# Altium project SSFocuser-C-DRV8825.PrjPcb
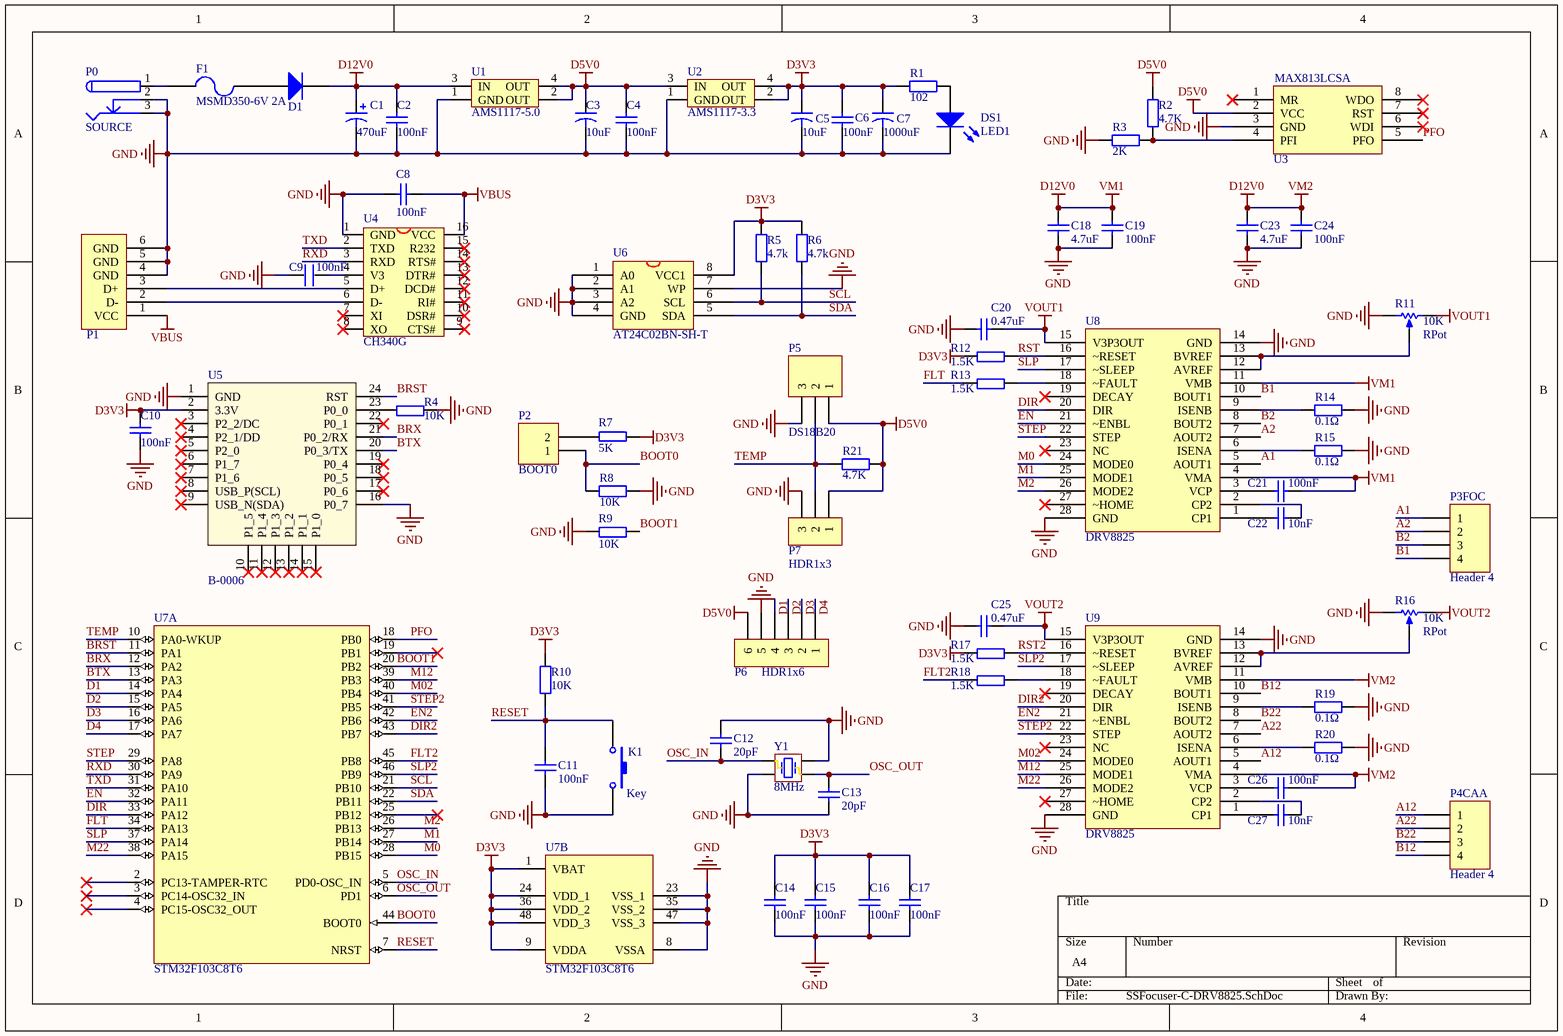
[diagram p0: SSFocuser-C-DRV8825.SchDoc]
1 sheet, 70 parts. Net scope: global (net labels, ports and power ports of the same name join across sheets).
Board file: SSFocuser-C-DRV8825.PcbDoc

## Sheet SSFocuser-C-DRV8825.SchDoc
size A4

### Parts
C1  470uF  [16V/470U(CD10X10D5)]
C2  100nF  [0603C]
C3  10uF  [3216]
C4  100nF  [0603C]
C5  10uF  [3216]
C6  100nF  [0603C]
C7  1000uF  [16V/470U(CD10X10D5)]
C8  100nF  [0603C]
C9  100nF  [0603C]
C10  100nF  [0603C]
C11  100nF  [0603C]
C12  20pF  [0603C]
C13  20pF  [0603C]
C14  100nF  [0603C]
C15  100nF  [0603C]
C16  100nF  [0603C]
C17  100nF  [0603C]
C18  4.7uF  [1206C]
C19  100nF  [0603C]
C20  0.47uF  [0603C]
C21  100nF  [0603C]
C22  10nF  [0603C]
C23  4.7uF  [1206C]
C24  100nF  [0603C]
C25  0.47uF  [0603C]
C26  100nF  [0603C]
C27  10nF  [0603C]
D1  M7  [DO-214AC]  (value not drawn)
DS1  LED1  [0805D]
F1  MSMD350-6V 2A  [1812R]
K1  Key  [SW-4*6]
P0  SOURCE  [DC_5.5MM]
P1  USB-B  [USB-B]  (value not drawn)
P2  BOOT0  [HDR1X2]
P3FOC  Header 4  [XH_4_V]
P4CAA  Header 4  [XH_4_V]
P5  DS18B20  [TO-92B]
P6  HDR1x6  [PIN-6-2.54-1.0]
P7  HDR1x3  [PIN-3-2.54-1.0]
R1  102  [0603R]
R2  4.7K  [0603R]
R3  2K  [0603R]
R4  10K  [0603R]
R5  4.7k  [0603R]
R6  4.7k  [0603R]
R7  5K  [0603R]
R8  10K  [0603R]
R9  10K  [0603R]
R10  10K  [0603R]
R11  RPot  value 10K  [VR_SMD]
R12  1.5K  [0603R]
R13  1.5K  [0603R]
R14  0.1Ω  [1206R]
R15  0.1Ω  [1206R]
R16  RPot  value 10K  [VR_SMD]
R17  1.5K  [0603R]
R18  1.5K  [0603R]
R19  0.1Ω  [1206R]
R20  0.1Ω  [1206R]
R21  4.7K  [0603R]
U1  AMS1117-5.0  [SOT223]
U2  AMS1117-3.3  [SOT223]
U3  MAX813LCSA  [SOP-8]
U4  CH340G  [SO-16]
U5  B-0006  [B-0006]
U6  AT24C02BN-SH-T  [SOP-8]
U7  STM32F103C8T6  [LQFP48_N]  (parts A,B of 2)
U8  DRV8825  [HTSSOP]
U9  DRV8825  [HTSSOP]
Y1  8MHz  [X3225]

### Nets
D3V3: C5.1 C6.2 C7.1 C10.2 C14.2 C15.2 C16.2 C17.2 R1.2 R5.2 R6.2 R7.1 R10.2 R12.1 R17.1 U2.2(OUT) U2.4(OUT) U5.2(3.3V) U6.8(VCC1) U7.1(VBAT) U7.9(VDDA) U7.24(VDD_1) U7.36(VDD_2) U7.48(VDD_3)
D5V0: C3.1 C4.2 P5.1 P6.6 P7.1 R2.2 R21.2 U1.2(OUT) U1.4(OUT) U2.3(IN) U3.2(VCC)
D12V0: C1.1 C2.2 C18.1 C19.1 C21.1 C23.1 C24.1 C26.1 D1.2(K) U1.3(IN) U8.4(VMA) U8.11(VMB) U9.4(VMA) U9.11(VMB)  [also labelled VM1, VM2]
GND: C1.2 C2.1 C3.2 C4.1 C5.2 C6.1 C7.2 C8.1 C9.1 C10.1 C11.1 C12.2 C13.2 C14.1 C15.1 C16.1 C17.1 C18.2 C19.2 C20.1 C23.2 C24.2 C25.1 DS1.2(K) K1.2 P0.2 P0.3 P1.4(GND) P1.5(GND) P1.6(GND) P5.3 P6.5 P7.3 R3.2 R4.2 R8.2 R9.1 R11.1(TOP) R14.1 R15.1 R16.1(TOP) R19.1 R20.1 U1.1(GND) U2.1(GND) U3.3(GND) U4.1(GND) U5.1(GND) U5.16(P0_7) U6.1(A0) U6.2(A1) U6.3(A2) U6.4(GND) U6.7(WP) U7.8(VSSA) U7.23(VSS_1) U7.35(VSS_2) U7.47(VSS_3) U8.14(GND) U8.28(GND) U9.14(GND) U9.28(GND) Y1.2(NA) Y1.4(NA)
VBUS: C8.2 P1.1(VCC) U4.16(VCC)
VOUT1: C20.2 R11.2(BOT) U8.15(V3P3OUT)
VOUT2: C25.2 R16.2(BOT) U9.15(V3P3OUT)
A1: P3FOC.1 U8.5(AOUT1)
A2: P3FOC.2 U8.7(AOUT2)
A12: P4CAA.1 U9.5(AOUT1)
A22: P4CAA.2 U9.7(AOUT2)
B1: P3FOC.4 U8.10(BOUT1)
B2: P3FOC.3 U8.8(BOUT2)
B12: P4CAA.4 U9.10(BOUT1)
B22: P4CAA.3 U9.8(BOUT2)
BOOT0: P2.1 R8.1 U7.44(BOOT0)
BOOT1: R9.2 U7.20(PB2)
BRST: U5.24(RST) U7.11(PA1)
BRX: U5.21(P0_2/RX) U7.12(PA2)
BTX: U5.20(P0_3/TX) U7.13(PA3)
D1: P6.4 U7.14(PA4)
D2: P6.3 U7.15(PA5)
D3: P6.2 U7.16(PA6)
D4: P6.1 U7.17(PA7)
DIR: U7.33(PA12) U8.20(DIR)
DIR2: U7.43(PB7) U9.20(DIR)
EN: U7.32(PA11) U8.21(~ENBL)
EN2: U7.42(PB6) U9.21(~ENBL)
FLT: R13.1 U7.34(PA13)
FLT2: R18.1 U7.45(PB8)
M0: U7.28(PB15) U8.24(MODE0)
M1: U7.27(PB14) U8.25(MODE1)
M02: U7.40(PB4) U9.24(MODE0)
M2: U7.26(PB13) U8.26(MODE2)
M12: U7.39(PB3) U9.25(MODE1)
M22: U7.38(PA15) U9.26(MODE2)
OSC_IN: C12.1 U7.5(PD0-OSC_IN) Y1.1(OSC1)
OSC_OUT: C13.1 U7.6(PD1) Y1.3(OSC2)
PFO: U3.5(PFO) U7.18(PB0)
RESET: C11.2 K1.1 R10.1 U7.7(NRST)
RST: R12.2 U8.16(~RESET)
RST2: R17.2 U9.16(~RESET)
RXD: U4.3(RXD) U7.30(PA9)
SCL: R5.1 U6.6(SCL) U7.21(PB10)
SDA: R6.1 U6.5(SDA) U7.22(PB11)
SLP: U7.37(PA14) U8.17(~SLEEP)
SLP2: U7.46(PB9) U9.17(~SLEEP)
STEP: U7.29(PA8) U8.22(STEP)
STEP2: U7.41(PB5) U9.22(STEP)
TEMP: P5.2 P7.2 R21.1 U7.10(PA0-WKUP)
TXD: U4.2(TXD) U7.31(PA10)
NetC9_2: C9.2 U4.4(V3)
NetC21_2: C21.2 U8.3(VCP)
NetC22_1: C22.1 U8.2(CP2)
NetC22_2: C22.2 U8.1(CP1)
NetC26_2: C26.2 U9.3(VCP)
NetC27_1: C27.1 U9.2(CP2)
NetC27_2: C27.2 U9.1(CP1)
NetD1_1: D1.1(A) F1.1
NetDS1_1: DS1.1(A) R1.1
NetF1_2: F1.2 P0.1
NetP1_2: P1.2(D-) U4.6(D-)
NetP1_3: P1.3(D+) U4.5(D+)
NetP2_2: P2.2 R7.2
NetR2_1: R2.1 R3.1 U3.4(PFI)
NetR4_1: R4.1 U5.23(P0_0)
NetR11_3: R11.3(TAP) U8.12(AVREF) U8.13(BVREF)
NetR13_2: R13.2 U8.18(~FAULT)
NetR14_2: R14.2 U8.9(ISENB)
NetR15_2: R15.2 U8.6(ISENA)
NetR16_3: R16.3(TAP) U9.12(AVREF) U9.13(BVREF)
NetR18_2: R18.2 U9.18(~FAULT)
NetR19_2: R19.2 U9.9(ISENB)
NetR20_2: R20.2 U9.6(ISENA)

Not connected (* = marked no-connect by the designer): U3 1(MR)* 6(WDI)* 7(RST)* 8(WDO)*; U4 7(XI)* 8(XO)* 9(CTS#)* 10(DSR#)* 11(RI#)* 12(DCD#)* 13(DTR#)* 14(RTS#)* 15(R232)*; U5 3(P2_2/DC)* 4(P2_1/DD)* 5(P2_0)* 6(P1_7)* 7(P1_6)* 8(USB_P(SCL))* 9(USB_N(SDA))* 10(P1_5)* 11(P1_4)* 12(P1_3)* 13(P1_2)* 14(P1_1)* 15(P1_0)* 17(P0_6)* 18(P0_5)* 19(P0_4)* 22(P0_1)*; U7 2(PC13-TAMPER-RTC)* 3(PC14-OSC32_IN)* 4(PC15-OSC32_OUT)* 19(PB1)* 25(PB12)*; U8 19(DECAY)* 23(NC)* 27(~HOME)*; U9 19(DECAY)* 23(NC)* 27(~HOME)*

### Library data of the parts
C1 = C470UF016S: 470UF      16V      CD10X10D5
C2 C4 C6 C8 C10-C27 = Cap: Capacitor; Published: 8-Jun-2000; LatestRevisionDate: 17-Jul-2002; LatestRevisionNote: Re-released for DXP Platform.; PackageReference: RAD-0.3; Publisher: Altium Limited
  C2 C4 C6 C8 C10 C11 C14-C17 C19 C21 C24 C26: Value: 100nF
  C12 C13: Value: 20pF
  C18 C23: Value: 4.7uF
  C20 C25: Value: 0.47uF
  C22 C27: Value: 10nF
C3 C5 C7 = CAP2
  C3 C5: vaule: 10uF
  C7: vaule: 1000uF
C9 = C
D1 = Diode: High Conductance Fast Diode; pin to pad: 1>2 2>1; Published: 8-Jun-2000; LatestRevisionDate: 17-Jul-2002; LatestRevisionNote: Re-released for DXP Platform.; DatasheetDocument: 1997; PackageReference: DO-35; Publisher: Altium Limited; Code_JEDEC: DO-204-AH; ComponentLink1Description: Manufacturer Link; ComponentLink1URL: http://www.fairchildsemi.com/; ComponentLink2Description: Datasheet; ComponentLink2URL: http://www.fairchildsemi.com/ds/1N%2F1N4448.pdf
DS1 = LED2: Typical RED, GREEN, YELLOW, AMBER GaAs LED; Published: 8-Jun-2000; LatestRevisionDate: 17-Jul-2002; LatestRevisionNote: Re-released for DXP Platform.; PackageDocument: Feb-2002; PackageReference: 3.2X1.6X1.1; Publisher: Altium Limited
F1 = FUSE2: Fuse
K1 = KEY2: Switch; Published: 24-Mar-1999; LatestRevisionDate: 17-Jul-2002; LatestRevisionNote: Re-released for DXP Platform.; PackageReference: SPST-2; Publisher: Altium Limited
P2 = MHDR1X2: Header, 2-Pin; LatestRevisionDate: 17-Jul-2002; LatestRevisionNote: Re-released for DXP Platform.; Publisher: Altium Limited
P3FOC P4CAA = Header 4: Header, 4-Pin; LatestRevisionDate: 17-Jul-2002; LatestRevisionNote: Re-released for DXP Platform.; Publisher: Altium Limited
P5 = Header 3: Header, 3-Pin; LatestRevisionDate: 17-Jul-2002; LatestRevisionNote: Re-released for DXP Platform.; Publisher: Altium Limited
P6 = HDR1x6: Connector
P7 = HDR1x3: Connector
R1-R3 R5 R6 R8 R10 R14 R15 R19-R21 = RES: Resistor; Value: 1K; Published: 8-Jun-2000; Revision: July-2002: Re-released for DXP Platform.; Publisher: Altium Limited
R4 R7 R9 R12 R13 R17 R18 = R
R11 R16 = RPot: Potentiometer; Sim Note: Enter the Resistance value and the set point into parameter fields.; Set Position: 0.5; Published: 8-Jun-2000; LatestRevisionDate: 17-Jul-2002; LatestRevisionNote: Re-released for DXP Platform.; PackageReference: VR5; Publisher: Altium Limited; PackageDescription: Variable Resistor, Thru-Hole; 3 Leads
U1 U2 = AMS1117
U3 = MAX813L
U4 = CH340G: USB2UART
U6 = 24C256
U7 = STM32F103C8T6: STM32 ARM-based 32-bit MCU Performance Line with 64 kB Flash, 20 kB Internal RAM, -40 to +85癈 Temperature, 48-Pin LQFP, Tray; DatasheetVersion: rev13.0, Apr-2011; PackageVersion: rev13, Apr-2011; PackageReference: LQFP48; PackageDescription: 48-Pin Low-Profile Quad Flat Pack, 7 x 7 mm Body, 0.5 mm Pitch (LQFP48); ComponentLink1Description: Manufacturer URL; ComponentLink1URL: http://www.st.com/; ComponentLink2Description: STM32F103 Datasheet; ComponentLink2URL: http://www.st.com/internet/com/TECHNICAL_RESOURCES/TECHNICAL_LITERATURE/DATASHEET/CD00161566.pdf; ComponentLink3Description: STM32 Family Web Page; ComponentLink3URL: www.st.com/stm32
Y1 = XTAL_1: Crystal Oscillator; Published: 8-Jun-2000; LatestRevisionDate: 17-Jul-2002; LatestRevisionNote: Re-released for DXP Platform.; PackageReference: R38; Publisher: Altium Limited; Value: 8MHz
P0 = SOURCE: LatestRevisionDate: 17-Jul-2002; LatestRevisionNote: Re-released for DXP Platform.; Publisher: Altium Limited